# Altium schematic sheet Part3 3210105209 谌梓轩.SchDoc
size A4; SheetNumber: 3; SheetTotal: 3
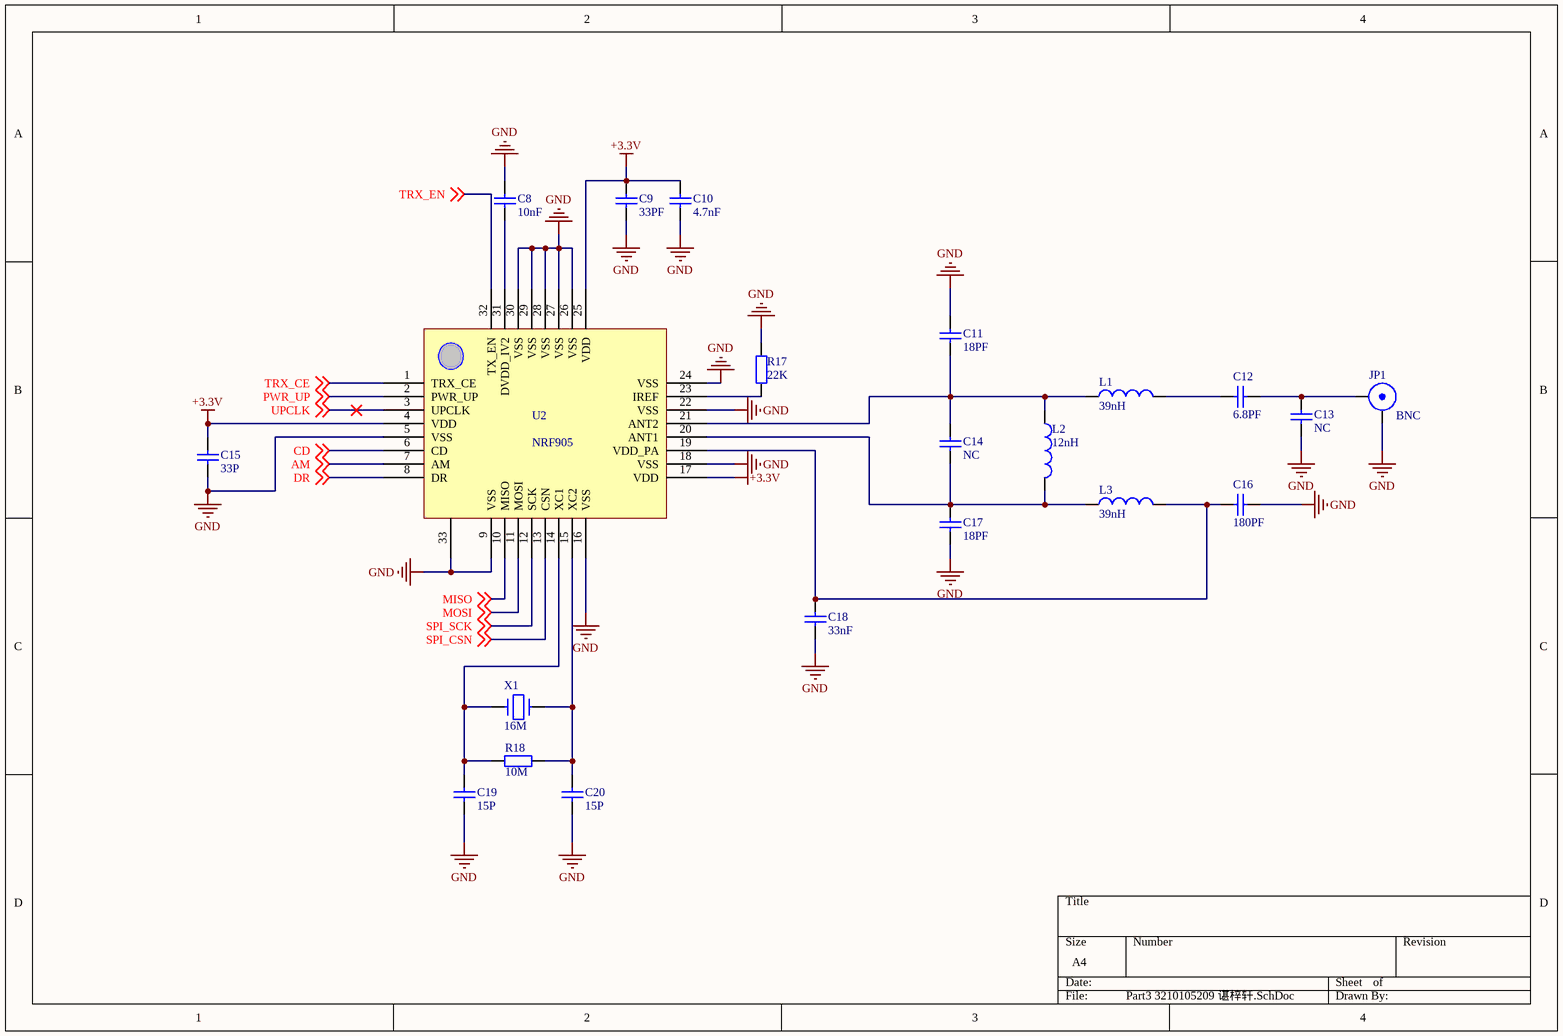
[diagram p0: Part3 3210105209 谌梓轩.SchDoc]

## Parts
C8  10nF  [0603C]
C9  33PF  [0603C]
C10  4.7nF  [0603C]
C11  18PF  [0603C]
C12  6.8PF  [0603C]
C13  NC  [0603C]
C14  NC  [0603C]
C15  33P  [0603C]
C16  180PF  [0603C]
C17  18PF  [0603C]
C18  33nF  [0603C]
C19  15P  [0603C]
C20  15P  [0603C]
JP1  BNC  [SMA]
L1  39nH  [0603-D]
L2  12nH  [0603-D]
L3  39nH  [0603-D]
R17  22K  [0603R]
R18  10M  [0603R]
U2  NRF905  [QFN32_M]
X1  16M  [CY2]

## Nets
+3.3V: C9.2 C10.2 C15.2 U2.4(VDD) U2.17(VDD) U2.25(VDD)
GND: C8.2 C9.1 C10.1 C11.2 C13.1 C15.1 C16.2 C17.1 C18.1 C19.1 C20.1 JP1.1 R17.2 U2.5(VSS) U2.9(VSS) U2.16(VSS) U2.18(VSS) U2.22(VSS) U2.24(VSS) U2.26(VSS) U2.27(VSS) U2.28(VSS) U2.29(VSS) U2.30(VSS) U2.33
AM: U2.7(AM) ; off-sheet AM
CD: U2.6(CD) ; off-sheet CD
DR: U2.8(DR) ; off-sheet DR
MISO: U2.10(MISO) ; off-sheet MISO
MOSI: U2.11(MOSI) ; off-sheet MOSI
PWR_UP: U2.2(PWR_UP) ; off-sheet PWR_UP
SPI_CSN: U2.13(CSN) ; off-sheet SPI_CSN
SPI_SCK: U2.12(SCK) ; off-sheet SPI_SCK
TRX_CE: U2.1(TRX_CE) ; off-sheet TRX_CE
TRX_EN: U2.32(TX_EN) ; off-sheet TRX_EN
UPCLK: U2.3(UPCLK) ; off-sheet UPCLK
NetC8_1: C8.1 U2.31(DVDD_IV2)
NetC11_1: C11.1 C14.2 L1.1 L2.1 U2.21(ANT2)
NetC12_1: C12.1 L1.2
NetC12_2: C12.2 C13.2 JP1.2
NetC14_1: C14.1 C17.2 L2.2 L3.1 U2.20(ANT1)
NetC16_1: C16.1 C18.2 L3.2 U2.19(VDD_PA)
NetC19_2: C19.2 R18.1 U2.14(XC1) X1.1
NetC20_2: C20.2 R18.2 U2.15(XC2) X1.2
NetR17_1: R17.1 U2.23(IREF)

## Library data of the parts
C8-C20 = Cap: Capacitor; Value: 75nF; Published: 8-Jun-2000; LatestRevisionDate: 17-Jul-2002; LatestRevisionNote: Re-released for DXP Platform.; PackageReference: RAD-0.3; Publisher: Altium Limited; PackageDescription: Radial Cap, Thru-Hole; 2 Leads; 0.3 in Pin Spacing
L1-L3 = INDUCTOR
R17 R18 = Res2: Resistor; Value: 16K; Published: 8-Jun-2000; LatestRevisionDate: 17-Jul-2002; LatestRevisionNote: Re-released for DXP Platform.; PackageReference: AXIAL-0.4; Publisher: Altium Limited; PackageDescription: Axial Device, Thru-Hole; 2 Leads; 0.4 in Pin Spacing
U2 = Component_1_1
X1 = CRYSTAL